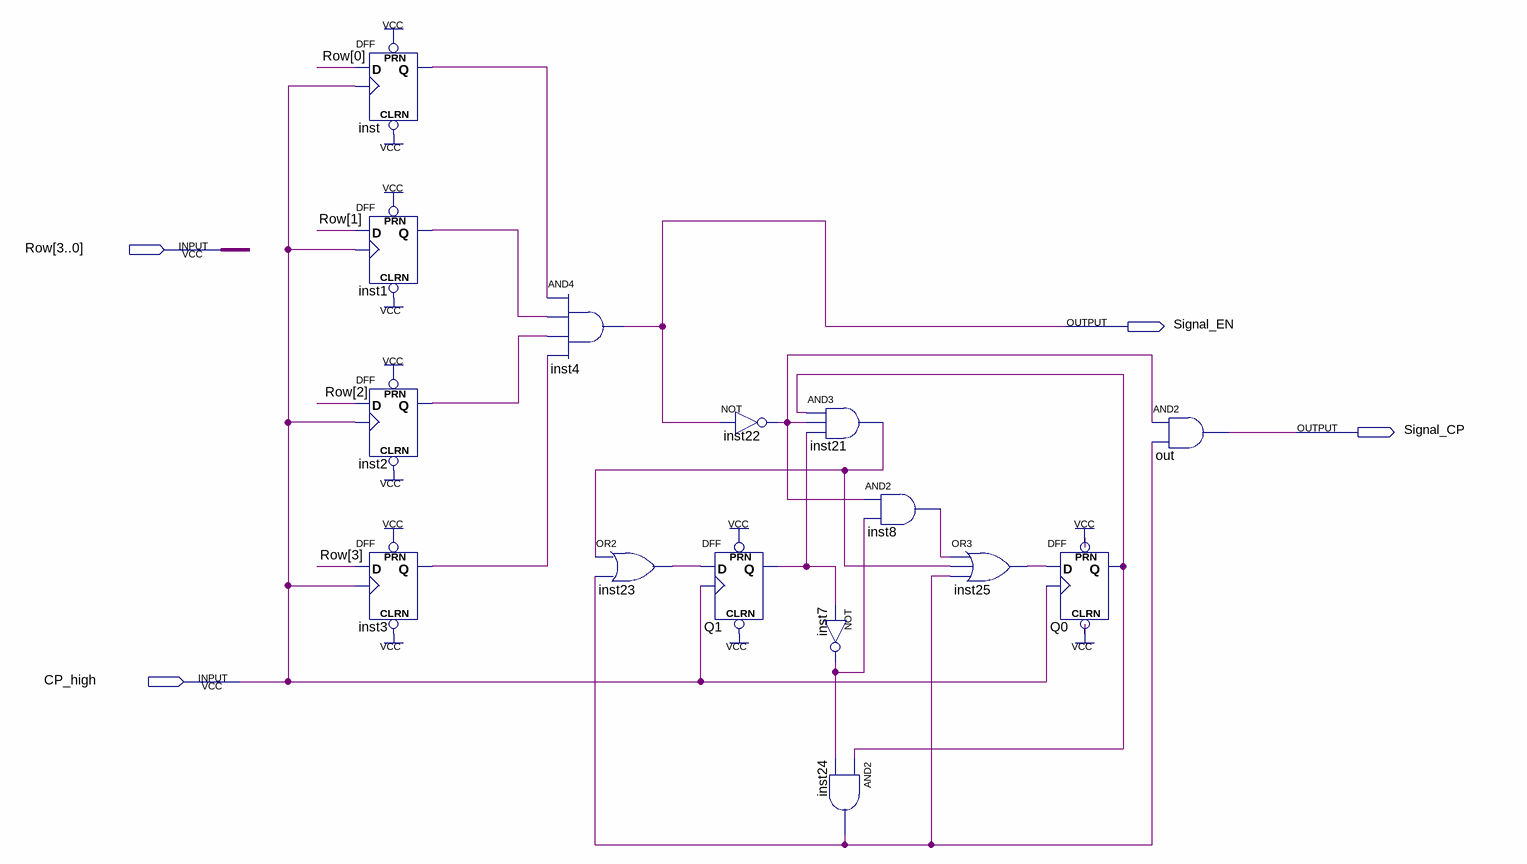
[diagram p0: schematic sheet]
// Quartus schematic Trigger.bdf as structural Verilog: 15 symbols, 4 pins
module Trigger (
  input  [3:0] Row,
  input  CP_high,
  output Signal_EN,
  output Signal_CP
);

  wire inst1_q, inst2_q, inst3_q, inst7_out, inst8_out, inst21_out, inst22_out, inst23_out, inst24_out,
       inst25_out, inst_q, Q0_q, Q1_q;

  DFF inst (.CLRN(1'b1), .CLK(CP_high), .D(Row[0]), .PRN(1'b1), .Q(inst_q));
  DFF inst1 (.CLRN(1'b1), .CLK(CP_high), .D(Row[1]), .PRN(1'b1), .Q(inst1_q));
  DFF inst2 (.CLRN(1'b1), .CLK(CP_high), .D(Row[2]), .PRN(1'b1), .Q(inst2_q));
  DFF inst3 (.CLRN(1'b1), .CLK(CP_high), .D(Row[3]), .PRN(1'b1), .Q(inst3_q));
  and inst4 (Signal_EN, inst_q, inst1_q, inst2_q, inst3_q);
  or inst23 (inst23_out, inst21_out, inst24_out);
  DFF Q1 (.CLRN(1'b1), .CLK(CP_high), .D(inst23_out), .PRN(1'b1), .Q(Q1_q));
  not inst22 (inst22_out, Signal_EN);
  and inst21 (inst21_out, Q0_q, inst22_out, Q1_q);
  and inst8 (inst8_out, inst22_out, inst7_out);
  not inst7 (inst7_out, Q1_q);
  and inst24 (inst24_out, Q0_q, inst7_out);
  or inst25 (inst25_out, inst8_out, inst21_out, inst24_out);
  DFF Q0 (.CLRN(1'b1), .CLK(CP_high), .D(inst25_out), .PRN(1'b1), .Q(Q0_q));
  and out (Signal_CP, inst22_out, inst24_out);
endmodule
